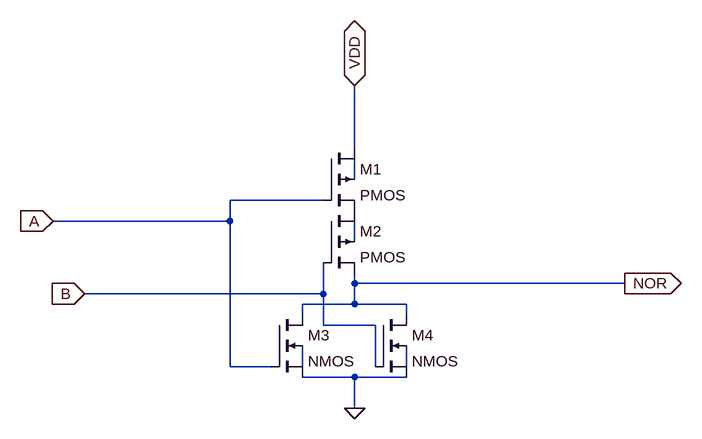
[diagram p0: schematic Static_NOR.asc]
Static_NOR.asc, the LTspice schematic file:
Version 4
SHEET 1 880 680
WIRE 160 32 160 -64
WIRE 160 80 160 48
WIRE 112 112 -32 112
WIRE -32 144 -32 112
WIRE -32 144 -304 144
WIRE 160 176 160 144
WIRE 160 240 160 224
WIRE 576 240 160 240
WIRE 112 256 112 208
WIRE 112 256 -256 256
WIRE 160 272 160 240
WIRE 160 272 80 272
WIRE 240 272 160 272
WIRE 80 288 80 272
WIRE 240 288 240 272
WIRE 112 304 112 256
WIRE 192 304 112 304
WIRE -32 368 -32 144
WIRE 32 368 -32 368
WIRE 80 368 80 336
WIRE 192 368 192 304
WIRE 240 368 240 336
WIRE 160 384 80 384
WIRE 240 384 160 384
WIRE 160 432 160 384
FLAG 160 432 0
FLAG 576 240 NOR
IOPIN 576 240 Out
FLAG -304 144 A
IOPIN -304 144 In
FLAG -256 256 B
IOPIN -256 256 In
FLAG 160 -64 VDD
IOPIN 160 -64 BiDir
SYMBOL pmos4 112 32 R0
SYMATTR InstName M1
SYMBOL pmos4 112 128 R0
SYMATTR InstName M2
SYMBOL nmos4 32 288 R0
SYMATTR InstName M3
SYMBOL nmos4 192 288 R0
SYMATTR InstName M4

The netlist it stands for:
* Static_NOR.asc
M1 VDD A P001 N001 PMOS
M2 P001 B NOR N002 PMOS
M3 NOR A 0 N003 NMOS
M4 NOR B 0 N004 NMOS
.model NMOS NMOS
.model PMOS PMOS
.lib standard.mos
.backanno
.end